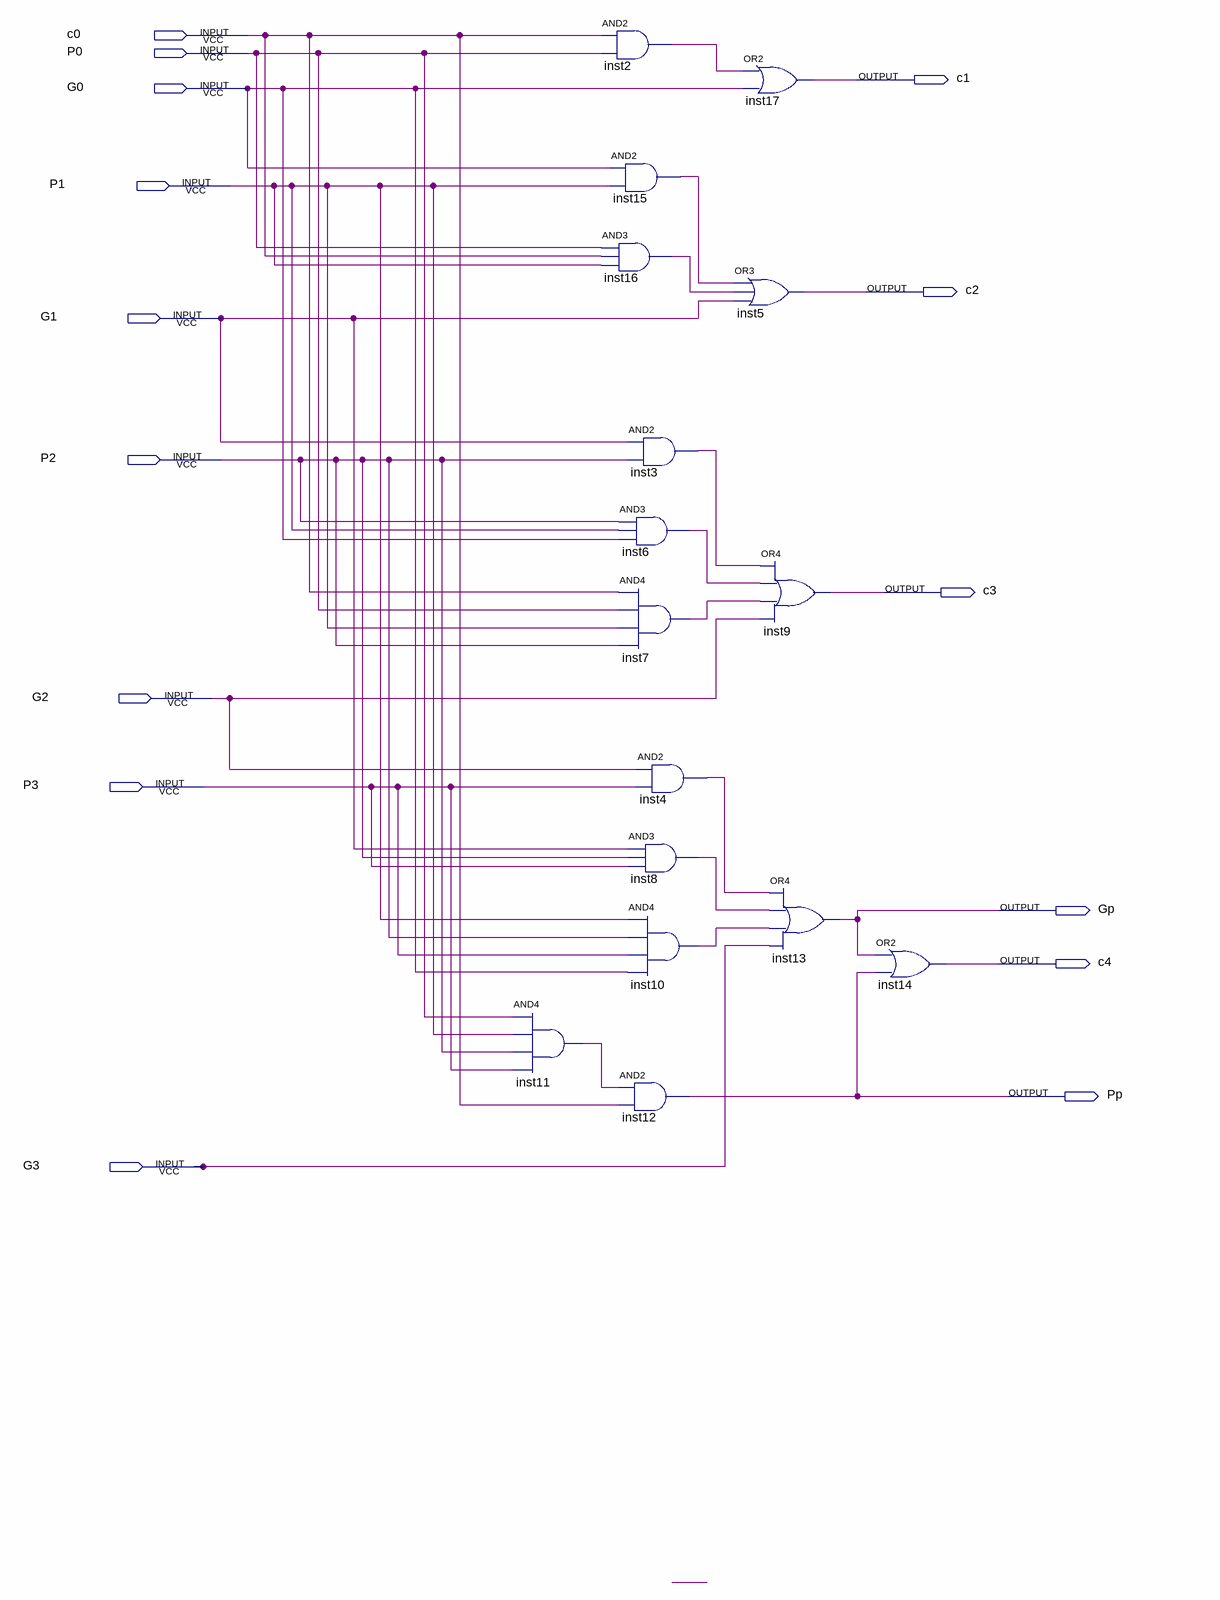
[diagram p0: schematic sheet]
// Quartus schematic carrylookaheadlogic.bdf as structural Verilog: 16 symbols, 15 pins
module carrylookaheadlogic (
  input  c0,
  input  P0,
  input  G0,
  input  P1,
  input  G1,
  input  P2,
  input  G2,
  input  P3,
  input  G3,
  output c1,
  output c2,
  output c3,
  output Gp,
  output c4,
  output Pp
);

  wire inst2_out, inst3_out, inst4_out, inst6_out, inst7_out, inst8_out, inst10_out, inst11_out, inst15_out,
       inst16_out;

  and inst11 (inst11_out, P0, P1, P2, P3);
  and inst2 (inst2_out, c0, P0);
  and inst15 (inst15_out, G0, P1);
  and inst16 (inst16_out, P0, c0, P1);
  and inst3 (inst3_out, G1, P2);
  and inst6 (inst6_out, P2, P1, G0);
  and inst7 (inst7_out, c0, P0, P1, P2);
  and inst4 (inst4_out, G2, P3);
  and inst8 (inst8_out, G1, P2, P3);
  and inst10 (inst10_out, P1, P2, P3, G0);
  and inst12 (Pp, inst11_out, c0);
  or inst17 (c1, inst2_out, G0);
  or inst5 (c2, inst15_out, inst16_out, G1);
  or inst9 (c3, inst3_out, inst6_out, inst7_out, G2);
  or inst13 (Gp, inst4_out, inst8_out, inst10_out, G3);
  or inst14 (c4, Gp, Pp);
endmodule
